# Altium schematic sheet CON_RS232DTE_DB9M.SchDoc: RS232 DTE DB9 Male
size A4; Organization: Altium Limited.; Address1: Level 3, 12a Rodborough Rd; Address2: Frenchs Forest 2086; Address3: NSW; Address4: AUSTRALIA; Revision: 6; SheetNumber: 50; SheetTotal: 64
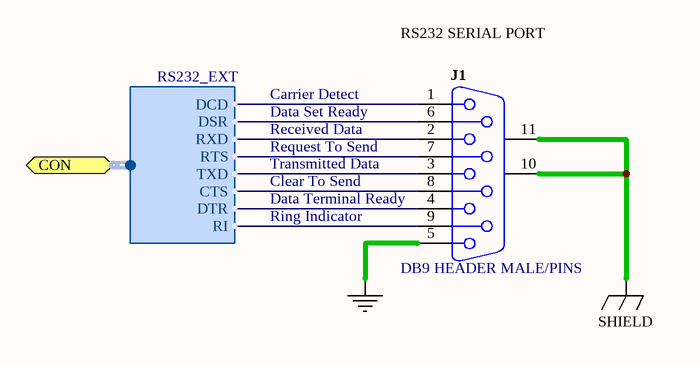
[diagram p0: CON_RS232DTE_DB9M.SchDoc]

## Parts
J1  DB9 HEADER MALE/PINS  [DSUB1.9_MALE]

## Ports
CON (harness RS232_EXT)

## Harnesses
RS232_EXT: DCD, RXD, TXD, DTR, DSR, RTS, CTS, RI

## Nets
GND: J1.5
SHIELD: J1.10(MH1) J1.11(MH2)
NetJ1_1: J1.1 ; port CON.DCD
NetJ1_2: J1.2 ; port CON.RXD
NetJ1_3: J1.3 ; port CON.TXD
NetJ1_4: J1.4 ; port CON.DTR
NetJ1_6: J1.6 ; port CON.DSR
NetJ1_7: J1.7 ; port CON.RTS
NetJ1_8: J1.8 ; port CON.CTS
NetJ1_9: J1.9 ; port CON.RI

## Notes on the sheet
- (near J1) RS232 SERIAL PORT
- (near J1) Transmitted Data
- Received Data
- Data Set Ready
- (near J1) Request To Send
- Carrier Detect
- (near J1) Data Terminal Ready
- Clear To Send
- Ring Indicator
- Sheet Title
- Project Title
- Size:
- Date:
- A4
- Assy:
- Time:
- Sheet
- Revision:
- of
- File:

## Library data of the parts
J1 = D-300-0027: Connector DB9 Right-Angle Male/Pins forked-board-lock; Max Current: mA; Category: Connector; Connector type: Header; Mounting Technology: Surface Mount; Pin Count: 9; Status: Production